# Altium project DSP_TMS320.PrjPcb
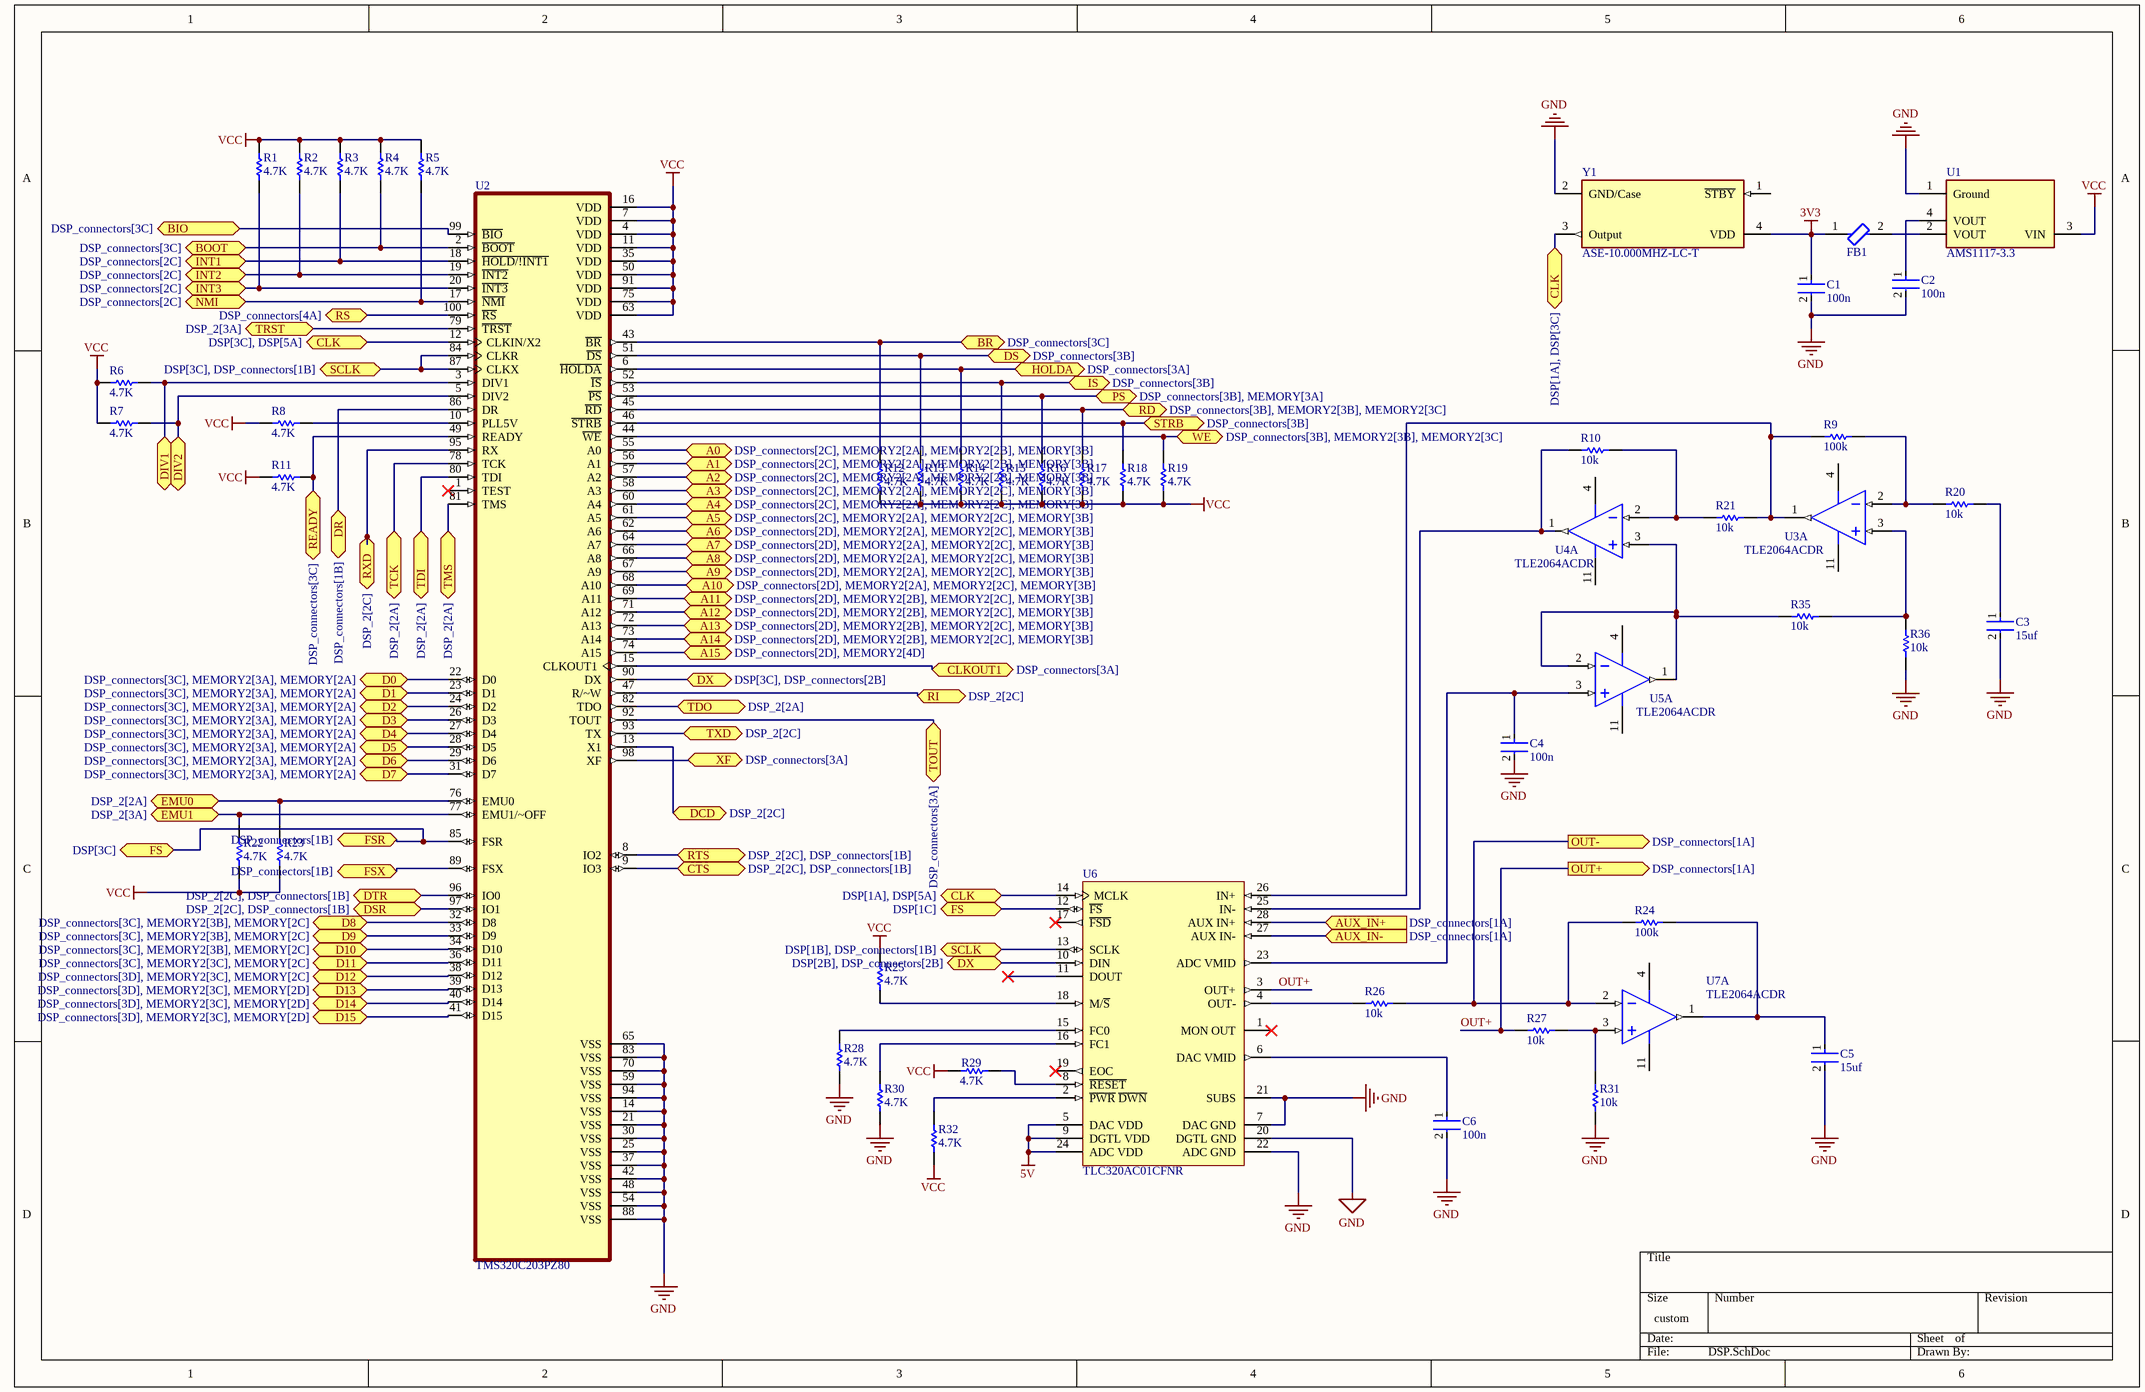
[diagram p0: DSP.SchDoc]
6 sheets, 84 parts. Net scope: flat (ports and power ports of the same name join across sheets).
Board file: DSP.PcbDoc
Sheets:
  DSP.SchDoc
  DSP_connectors.SchDoc
  DSP_2.SchDoc
  MEMORY.SchDoc
  MEMORY2.SchDoc
  power.SchDoc

## Sheet DSP.SchDoc
size 400 x 260 mm; SheetNumber: 1; SheetTotal: 6

### Parts
C1  100n  [FP-CL10-IPC_C]
C2  100n  [FP-CL10-IPC_C]
C3  15uf  [FP-CL10-IPC_C]
C4  100n  [FP-CL10-IPC_C]
C5  15uf  [FP-CL10-IPC_C]
C6  100n  [FP-CL10-IPC_C]
FB1  BLM18KG121TN1D  [FP-BLM18-0_15-t0_6-d1_2-IPC_A]  (value not drawn)
R1  4.7K  [RESC2013X60X35ML10T20]
R2  4.7K  [RESC2013X60X35ML10T20]
R3  4.7K  [RESC2013X60X35ML10T20]
R4  4.7K  [RESC2013X60X35ML10T20]
R5  4.7K  [RESC2013X60X35ML10T20]
R6  4.7K  [RESC2013X60X35ML10T20]
R7  4.7K  [RESC2013X60X35ML10T20]
R8  4.7K  [RESC2013X60X35ML10T20]
R9  100k  [RESC2013X60X35ML10T20]
R10  10k  [RESC2013X60X35ML10T20]
R11  4.7K  [RESC2013X60X35ML10T20]
R12  4.7K  [RESC2013X60X35ML10T20]
R13  4.7K  [RESC2013X60X35ML10T20]
R14  4.7K  [RESC2013X60X35ML10T20]
R15  4.7K  [RESC2013X60X35ML10T20]
R16  4.7K  [RESC2013X60X35ML10T20]
R17  4.7K  [RESC2013X60X35ML10T20]
R18  4.7K  [RESC2013X60X35ML10T20]
R19  4.7K  [RESC2013X60X35ML10T20]
R20  10k  [RESC2013X60X35ML10T20]
R21  10k  [RESC2013X60X35ML10T20]
R22  4.7K  [RESC2013X60X35ML10T20]
R23  4.7K  [RESC2013X60X35ML10T20]
R24  100k  [RESC2013X60X35ML10T20]
R25  4.7K  [RESC2013X60X35ML10T20]
R26  10k  [RESC2013X60X35ML10T20]
R27  10k  [RESC2013X60X35ML10T20]
R28  4.7K  [RESC2013X60X35ML10T20]
R29  4.7K  [RESC2013X60X35ML10T20]
R30  4.7K  [RESC2013X60X35ML10T20]
R31  10k  [RESC2013X60X35ML10T20]
R32  4.7K  [RESC2013X60X35ML10T20]
R35  10k  [RESC2013X60X35ML10T20]
R36  10k  [RESC2013X60X35ML10T20]
U1  AMS1117-3.3  [FP-AMS1117-IPC_C]
U2  TMS320C203PZ80  [QFP50P1600X1600X160-100N]
U3  TLE2064ACDR  [D0014A_M]  (part A of 4)
U4  TLE2064ACDR  [D0014A_M]  (part A of 4)
U5  TLE2064ACDR  [D0014A_M]  (part A of 4)
U6  TLC320AC01CFNR  [FN0028A_L]
U7  TLE2064ACDR  [D0014A_M]  (part A of 4)
Y1  ASE-10.000MHZ-LC-T  [FP-ASE-MFG]

### Ports
A0 (bidir, see DSP_connectors[2C], MEMORY2[2A], MEMORY2[2B], MEMORY[3B]), A1 (bidir, see DSP_connectors[2C], MEMORY2[2A], MEMORY2[2B], MEMORY[3B]), A2 (bidir, see DSP_connectors[2C], MEMORY2[2A], MEMORY2[2B], MEMORY[3B]), A3 (bidir, see DSP_connectors[2C], MEMORY2[2A], MEMORY2[2C], MEMORY[3B]), A4 (bidir, see DSP_connectors[2C], MEMORY2[2A], MEMORY2[2C], MEMORY[3B]), A5 (bidir, see DSP_connectors[2C], MEMORY2[2A], MEMORY2[2C], MEMORY[3B]), A6 (bidir, see DSP_connectors[2D], MEMORY2[2A], MEMORY2[2C], MEMORY[3B]), A7 (bidir, see DSP_connectors[2D], MEMORY2[2A], MEMORY2[2C], MEMORY[3B]), A8 (bidir, see DSP_connectors[2D], MEMORY2[2A], MEMORY2[2C], MEMORY[3B]), A9 (bidir, see DSP_connectors[2D], MEMORY2[2A], MEMORY2[2C], MEMORY[3B]), A10 (bidir, see DSP_connectors[2D], MEMORY2[2A], MEMORY2[2C], MEMORY[3B]), A11 (bidir, see DSP_connectors[2D], MEMORY2[2B], MEMORY2[2C], MEMORY[3B]), A12 (bidir, see DSP_connectors[2D], MEMORY2[2B], MEMORY2[2C], MEMORY[3B]), A13 (bidir, see DSP_connectors[2D], MEMORY2[2B], MEMORY2[2C], MEMORY[3B]), A14 (bidir, see DSP_connectors[2D], MEMORY2[2B], MEMORY2[2C], MEMORY[3B]), A15 (bidir, see DSP_connectors[2D], MEMORY2[4D]), AUX_IN+ (in, see DSP_connectors[1A]), AUX_IN- (in, see DSP_connectors[1A]), BIO (bidir, see DSP_connectors[3C]), BOOT (bidir, see DSP_connectors[3C]), BR (bidir, see DSP_connectors[3C]), CLK (bidir, see DSP[1A], DSP[3C]), CLK (bidir, see DSP[1A], DSP[5A]), CLK (bidir, see DSP[3C], DSP[5A]), CLKOUT1 (bidir, see DSP_connectors[3A]), CTS (bidir, see DSP_2[2C], DSP_connectors[1B]), D0 (bidir, see DSP_connectors[3C], MEMORY2[3A], MEMORY[2A]), D1 (bidir, see DSP_connectors[3C], MEMORY2[3A], MEMORY[2A]), D2 (bidir, see DSP_connectors[3C], MEMORY2[3A], MEMORY[2A]), D3 (bidir, see DSP_connectors[3C], MEMORY2[3A], MEMORY[2A]), D4 (bidir, see DSP_connectors[3C], MEMORY2[3A], MEMORY[2A]), D5 (bidir, see DSP_connectors[3C], MEMORY2[3A], MEMORY[2A]), D6 (bidir, see DSP_connectors[3C], MEMORY2[3A], MEMORY[2A]), D7 (bidir, see DSP_connectors[3C], MEMORY2[3A], MEMORY[2A]), D8 (bidir, see DSP_connectors[3C], MEMORY2[3B], MEMORY[2C]), D9 (bidir, see DSP_connectors[3C], MEMORY2[3B], MEMORY[2C]), D10 (bidir, see DSP_connectors[3C], MEMORY2[3B], MEMORY[2C]), D11 (bidir, see DSP_connectors[3C], MEMORY2[3C], MEMORY[2C]), D12 (bidir, see DSP_connectors[3D], MEMORY2[3C], MEMORY[2C]), D13 (bidir, see DSP_connectors[3D], MEMORY2[3C], MEMORY[2D]), D14 (bidir, see DSP_connectors[3D], MEMORY2[3C], MEMORY[2D]), D15 (bidir, see DSP_connectors[3D], MEMORY2[3C], MEMORY[2D]), DCD (bidir, see DSP_2[2C]), DIV1 (bidir), DIV2 (bidir), DR (bidir, see DSP_connectors[1B]), DS (bidir, see DSP_connectors[3B]), DSR (bidir, see DSP_2[2C], DSP_connectors[1B]), DTR (bidir, see DSP_2[2C], DSP_connectors[1B]), DX (bidir, see DSP[2B], DSP_connectors[2B]), DX (bidir, see DSP[3C], DSP_connectors[2B]), EMU0 (bidir, see DSP_2[2A]), EMU1 (bidir, see DSP_2[3A]), FS (bidir, see DSP[1C]), FS (bidir, see DSP[3C]), FSR (bidir, see DSP_connectors[1B]), FSX (bidir, see DSP_connectors[1B]), HOLDA (bidir, see DSP_connectors[3A]), INT1 (bidir, see DSP_connectors[2C]), INT2 (bidir, see DSP_connectors[2C]), INT3 (bidir, see DSP_connectors[2C]), IS (bidir, see DSP_connectors[3B]), NMI (bidir, see DSP_connectors[2C]), OUT+ (out, see DSP_connectors[1A]), OUT- (out, see DSP_connectors[1A]), PS (bidir, see DSP_connectors[3B], MEMORY[3A]), RD (bidir, see DSP_connectors[3B], MEMORY2[3B], MEMORY2[3C]), READY (bidir, see DSP_connectors[3C]), RI (bidir, see DSP_2[2C]), RS (bidir, see DSP_connectors[4A]), RTS (bidir, see DSP_2[2C], DSP_connectors[1B]), RXD (bidir, see DSP_2[2C]), SCLK (bidir, see DSP[1B], DSP_connectors[1B]), SCLK (bidir, see DSP[3C], DSP_connectors[1B]), STRB (bidir, see DSP_connectors[3B]), TCK (bidir, see DSP_2[2A]), TDI (bidir, see DSP_2[2A]), TDO (bidir, see DSP_2[2A]), TMS (bidir, see DSP_2[2A]), TOUT (bidir, see DSP_connectors[3A]), TRST (bidir, see DSP_2[3A]), TXD (bidir, see DSP_2[2C]), WE (bidir, see DSP_connectors[3B], MEMORY2[3B], MEMORY2[3C]), XF (bidir, see DSP_connectors[3A])

### Nets
3V3: C1.1 FB1.1 Y1.4(VDD)
5V: U6.5(DAC_VDD) U6.9(DGTL_VDD) U6.24(ADC_VDD)
GND: C1.2 C2.2 C3.2 C4.2 C5.2 C6.2 R28.2 R30.1 R31.1 R36.2 U1.1(Ground) U2.14(VSS) U2.21(VSS) U2.25(VSS) U2.30(VSS) U2.37(VSS) U2.42(VSS) U2.48(VSS) U2.54(VSS) U2.59(VSS) U2.65(VSS) U2.70(VSS) U2.83(VSS) U2.88(VSS) U2.94(VSS) U6.7(DAC_GND) U6.20(DGTL_GND) U6.21(SUBS) U6.22(ADC_GND) Y1.2(GND/Case)
VCC: R1.2 R2.2 R3.2 R4.2 R5.2 R6.2 R7.2 R8.1 R11.1 R12.2 R13.2 R14.2 R15.2 R16.2 R17.2 R18.2 R19.2 R22.1 R23.1 R25.2 R29.2 R32.1 U1.3(VIN) U2.4(VDD) U2.7(VDD) U2.11(VDD) U2.16(VDD) U2.35(VDD) U2.50(VDD) U2.63(VDD) U2.75(VDD) U2.91(VDD)
OUT+: R27.2 U6.3(OUT+) ; port OUT+
NetC2_1: C2.1 U1.4(VOUT)
NetC3_1: C3.1 R20.2
NetC4_1: C4.1 U5.3(IN1+) U6.23(ADC_VMID)
NetC5_1: C5.1 R24.1 U7.1(OUT1)
NetC6_1: C6.1 U6.6(DAC_VMID)
NetFB1_2: FB1.2 U1.2(VOUT)
NetJ1_3: R24.2 R26.1 U7.2(IN1-) ; port OUT-
NetJ1_5: U6.27(AUX_IN-) ; port AUX_IN-
NetJ1_6: U6.28(AUX_IN+) ; port AUX_IN+
NetJ1_14: U2.84(CLKR) U2.87(CLKX) U6.13(SCLK) ; port SCLK
NetJ1_17: U2.96(IO0) ; port DTR
NetJ1_18: U2.85(FSR) U6.12(~{FS}) ; port FS, port FSR
NetJ1_19: U2.97(IO1) ; port DSR
NetJ1_20: U2.89(FSX) ; port FSX
NetJ1_21: U2.8(IO2) ; port RTS
NetJ1_22: U2.86(DR) ; port DR
NetJ1_23: U2.9(IO3) ; port CTS
NetJ1_24: U2.90(DX) U6.10(DIN) ; port DX
NetJ2_1: U2.100(~{RS}) ; port RS
NetJ2_2: U2.92(TOUT) ; port TOUT
NetJ2_5: U2.98(XF) ; port XF
NetJ2_6: R14.1 U2.6(~{HOLDA}) ; port HOLDA
NetJ2_9: U2.15(CLKOUT1) ; port CLKOUT1
NetJ2_17: R18.1 U2.46(~{STRB}) ; port STRB
NetJ2_19: R16.1 U2.53(~{PS}) ; port PS
NetJ2_21: R13.1 U2.51(~{DS}) ; port DS
NetJ2_22: R15.1 U2.52(~{IS}) ; port IS
NetJ2_23: R17.1 U2.45(~{RD}) ; port RD
NetJ2_24: R19.1 U2.44(~{WE}) ; port WE
NetJ3_3: R11.2 U2.49(READY) ; port READY
NetJ3_4: R4.1 U2.2(~{BOOT}) ; port BOOT
NetJ3_5: U2.99(~{BIO}) ; port BIO
NetJ3_6: R12.1 U2.43(~{BR}) ; port BR
NetJ3_9: U2.22(D0) ; port D0
NetJ3_10: U2.23(D1) ; port D1
NetJ3_11: U2.24(D2) ; port D2
NetJ3_12: U2.26(D3) ; port D3
NetJ3_13: U2.27(D4) ; port D4
NetJ3_14: U2.28(D5) ; port D5
NetJ3_15: U2.29(D6) ; port D6
NetJ3_16: U2.31(D7) ; port D7
NetJ3_17: U2.32(D8) ; port D8
NetJ3_18: U2.33(D9) ; port D9
NetJ3_19: U2.34(D10) ; port D10
NetJ3_20: U2.36(D11) ; port D11
NetJ3_21: U2.38(D12) ; port D12
NetJ3_22: U2.39(D13) ; port D13
NetJ3_23: U2.40(D14) ; port D14
NetJ3_24: U2.41(D15) ; port D15
NetJ4_1: R3.1 U2.18(~{HOLD/!INT1}) ; port INT1
NetJ4_2: R2.1 U2.19(~{INT2}) ; port INT2
NetJ4_3: R1.1 U2.20(~{INT3}) ; port INT3
NetJ4_5: R5.1 U2.17(~{NMI}) ; port NMI
NetJ4_9: U2.55(A0) ; port A0
NetJ4_10: U2.56(A1) ; port A1
NetJ4_11: U2.57(A2) ; port A2
NetJ4_12: U2.58(A3) ; port A3
NetJ4_13: U2.60(A4) ; port A4
NetJ4_14: U2.61(A5) ; port A5
NetJ4_15: U2.62(A6) ; port A6
NetJ4_16: U2.64(A7) ; port A7
NetJ4_17: U2.66(A8) ; port A8
NetJ4_18: U2.67(A9) ; port A9
NetJ4_19: U2.68(A10) ; port A10
NetJ4_20: U2.69(A11) ; port A11
NetJ4_21: U2.71(A12) ; port A12
NetJ4_22: U2.72(A13) ; port A13
NetJ4_23: U2.73(A14) ; port A14
NetJ4_24: U2.74(A15) ; port A15
NetJ5_1: U2.81(TMS) ; port TMS
NetJ5_2: U2.79(~{TRST}) ; port TRST
NetJ5_3: U2.80(TDI) ; port TDI
NetJ5_7: U2.82(TDO) ; port TDO
NetJ5_9: U2.78(TCK) ; port TCK
NetJ5_13: R23.2 U2.76(EMU0) ; port EMU0
NetJ5_14: R22.2 U2.77(EMU1/~OFF) ; port EMU1
NetJ6_1: U2.13(X1) ; port DCD
NetJ6_2: U2.93(TX) ; port TXD
NetJ6_5: U2.47(R/~W) ; port RI
NetJ6_6: U2.95(RX) ; port RXD
NetR6_1: R6.1 U2.3(DIV1) ; port DIV1
NetR7_1: R7.1 U2.5(DIV2) ; port DIV2
NetR8_2: R8.2 U2.10(PLL5V)
NetR9_1: R9.1 R20.1 U3.2(IN1-)
NetR9_2: R9.2 R21.1 U3.1(OUT1) U6.26(IN+)
NetR10_1: R10.1 R21.2 U4.2(IN1-)
NetR10_2: R10.2 U4.1(OUT1) U6.25(IN-)
NetR25_1: R25.1 U6.18(M/~{S})
NetR26_2: R26.2 U6.4(OUT-)
NetR27_1: R27.1 R31.2 U7.3(IN1+)
NetR28_1: R28.1 U6.15(FC0)
NetR29_1: R29.1 U6.8(~{RESET})
NetR30_2: R30.2 U6.16(FC1)
NetR32_2: R32.2 U6.2(~{PWR}_~{DWN})
NetR35_1: R35.1 R36.1 U3.3(IN1+)
NetR35_2: R35.2 U4.3(IN1+) U5.1(OUT1) U5.2(IN1-)
NetU2_12: U2.12(CLKIN/X2) U6.14(MCLK) Y1.3(Output) ; port CLK

Not connected (* = marked no-connect by the designer): U2 1(TEST)*; U3 4(VCC+) 11(VCC-); U4 4(VCC+) 11(VCC-); U5 4(VCC+) 11(VCC-); U6 1(MON_OUT)* 11(DOUT)* 17(~{FSD})* 19(EOC)*; U7 4(VCC+) 11(VCC-); Y1 1(~{STBY})

### Library data of the parts
C1-C6 = CMP-13271-003017-1: Cap Ceramic 4.7uF 10V X5R ±10% Pad SMD 0603 +85°C T/R; Capacitance: 4.7uF; Case/Package: 0603; Packaging: Tape and Reel; Width: 0.031inch; Contact Plating: Tin; Thickness: 0.035inch; Package Quantity: 1; Voltage Rating: 10V; Case Code (Metric): 1608; Case Code (Imperial): 0603; Depth: 0.8mm; Height: 0.8mm; Tolerance: 10%; Max Operating Temperature: 85°C; Length: 1.6mm; Dielectric: X5R; Mount: Surface Mount; Radiation Hardening: No; Min Operating Temperature: -55°C
FB1 = CMP-0686-00554-8: FERRITE BEAD 120 OHM 0603 1LN; Max Current Rating: 3A; DC Resistance (DCR): 30mR; Impedance: 120R; Number of Lines: 1; Test Frequency: 100MHz; Tolerance: 25%; Package Quantity: 4000; Min Operating Temperature: -55°C; Termination: SMD/SMT; REACH SVHC: No SVHC; Core Material: Ferrite; Material: Ferrite; Current Rating: 3A; Height: 0.8mm; Number of Pins: 2; Case/Package: 0603; Case Code (Imperial): 0603; Series: BLM18K; Packaging: Tape and Reel; Inductor Type: FERRITE BEAD; Lead Free: Lead Free; Width: 0.8mm; Case Code (Metric): 1608; Number of Circuits: 1; Max DC Current: 3A; Depth: 0.95mm; Max Operating Temperature: 125°C; Length: 1.6mm; RoHS Compliant: Yes
R1-R32 R35 R36 = CMP-2100-03673-1: Chip Resistor, 0 Ohm, Jumper, +/- 5%, 0.125 W, -55 to 155 degC, 0805 (2012 Metric), RoHS, Tape and Reel; Manufacturer: Yageo; Power Rating: 125mW; Resistance: 0mOhm; Voltage Rating (DC): 150V; Temperature Coefficient: 200ppm/degreesC; Height: 0.5mm; Depth: 1.25mm; Case Code (Imperial): 0805; Lead Free: LeadFree; Military Standard: Not; Package Description: 2-Pin Surface Mounted Device, Body 2 x 1.25 mm; Case Code (Metric): 2012; Composition: ThickFilm; Voltage Rating: 150V; Manufacturer URL: http://www.yageo.com/; Packaging: TapeandReel; Package Reference: 0805; REACH SVHC: Unknown; Tolerance: 5%; Case/Package: 0805; Max Operating Temperature: 155degC; Number of Pins: 2; Min Operating Temperature: -55degC; RoHSCompliant: true; Length: 2mm; Datasheet URL: http://www.yageo.com/NewPortal/yageodocoutput?fileName=/pdf/R-Chip/PYu-RC_Group_51_RoHS_L_5.pdf; Termination: SMD/SMT; Radiation Hardening: No; Width: 1.25mm; Contact Plating: Tin; Datasheet Version: Rev. 5, 10/2016
U1 = CMP-209535-000001-1: LDO Voltage Regulators 1A, 3.3V; Manufacturer: Advanced Monolithic Systems; Dropout Voltage: 1.1V; Output Type: Fixed; Nominal Supply Current: 5mA; Max Power Dissipation: 1.2W; Max Supply Voltage: 15V; Number Of Outputs: 1; Standoff Height: 0.64mm; Max Junction Temp: +125°C; Height: 1.8mm; Package: AMS1117; Device Class L2: Power Management ICs; ComponentLink2Description: Datasheet; ComponentLink2URL: http://www.advanced-monolithic.com/pdf/ds1117.pdf; Category: IC; RoHS: TRUE; Automotive: No; Device Class L1: Integrated Circuits (ICs); Output Current: 1A; Device Class L3: Voltage Regulators - Linear; Temperature: -40°C to +125°C; Output Voltage: 3.3V; Manufacturer Part Number: AMS1117-3.3; Temperature Range Low: -40°C; Octopart: https://octopart.com/ams1117-3.3-advanced+monolithic+systems-25899300; Lead Free: Yes; Ipc Land Pattern Name: SOT229P700X180-4; Temperature Range High: +125°C
U3-U5 U7 = CMP-0272-01885-3: Excalibur JFET-Input High-Output-Drive uPower Quad Operational Amplifier, 7 to 36 V, 0 to70 degC, 14-pin SOIC (D14), Green (RoHS & no Sb/Br); Manufacturer: Texas Instruments; IIB(Max)(pA): 2000; Vio (25C)(Max)(mV): 6; Total Supply Voltage(Min)(+5V is 5, +/-5V is 10): 7; Rating: Catalog; Sub Family: High Supply Voltage Amplifier (>=30V), Low Power Amp (<=500uA), Precision Amplifier; CMRR(Min)(dB): 65; Packing: LARGE T&R; Total Supply Voltage(Max)(+5V is 5, +/-5V is 10): 36; Number of Channels: 4; Iq per channel(Max)(mA): 0.325; Slew Rate(Typ)(V/us): 3.4; GBW(Typ)(MHz): 1.8; Code_JEDEC: MS-012; Eco-Plan: Green (RoHS & no Sb/Br); ComponentLink2Description: Datasheet; PackageVersion: 4040047-5/M, 06/2011; ComponentLink3Description: Package Specification; Offset Drift(Typ)(uV/C): 6; PackageDescription: 14-Pin Plastic Small Outline, Body 8.65 x 3.9 mm, Pitch 1.27 mm; Mounting Technology: Surface Mount; PackageReference: D0014A; ComponentLink2URL: http://www.ti.com/lit/ds/symlink/tle2064a.pdf; DatasheetVersion: SLOS193B; ComponentLink3URL: http://www.ti.com/lit/ml/mpds177g/mpds177g.pdf; PartNumber: TLE2064ACDR; ComponentLink1Description: Manufacturer URL; ComponentLink1URL: http://www.ti.com/
U6 = CMP-0331-00025-2: Single Channel CODEC-Bandwidth Independent of Sampling Rate, 0 to 70 degC, 28-pin PLCC (FN), Green (RoHS & no Sb/Br); Manufacturer: Texas Instruments; Sampling Rate (Max) (kHz): 25; Line Powered: TRUE; PackageDescription: 28-Pin Plastic J-Leaded Chip Carrier, 1.27 mm Pitch; DatasheetVersion: SLAS057D; PackageVersion: revB, Mar-1995; ComponentLink1Description: Datasheet; ComponentLink1URL: http://www.ti.com/general/docs/lit/getliterature.tsp?genericPartNumber=TLC320AC01&fileType=pdf; Mounting Technology: Surface Mount; Code_JEDEC: MS-018; PartNumber: TLC320AC01CFNR; PackageReference: FN0028A
Y1 = CMP-27762-014276-1: XTAL Oscillator 10MHz ±50ppm CMOS 3.3V 4-SMD 3.2mm x 2.5mm; Max Supply Voltage: 3.465V; Max Supply Current: 7mA; Load Capacitance: 15pF; Min Supply Voltage: 3.135V; Number of Pins: 4; Case/Package: SMD/SMT; Lead Free: Lead Free; Depth: 2.5mm; Radiation Hardening: No; Width: 0.098inch; Length: 3.2mm; Termination: SMD/SMT; Min Operating Temperature: -40°C; Operating Supply Voltage: 3.3V; Series: ASE; Packaging: Tape and Reel; REACH SVHC: No SVHC; Mount: Surface Mount; Frequency: 10MHz; Package Quantity: 1000; Max Operating Temperature: 85°C; Operating Frequency: 10 MHz; Height: 0.047inch; Frequency Stability: 50ppm
U2 = TMS320C203PZ80: Package: None; Price: None; Value: *; MP: TMS320C203PZ80; Availability: Unavailable

## Sheet DSP_connectors.SchDoc
size A; SheetNumber: 2; SheetTotal: 6
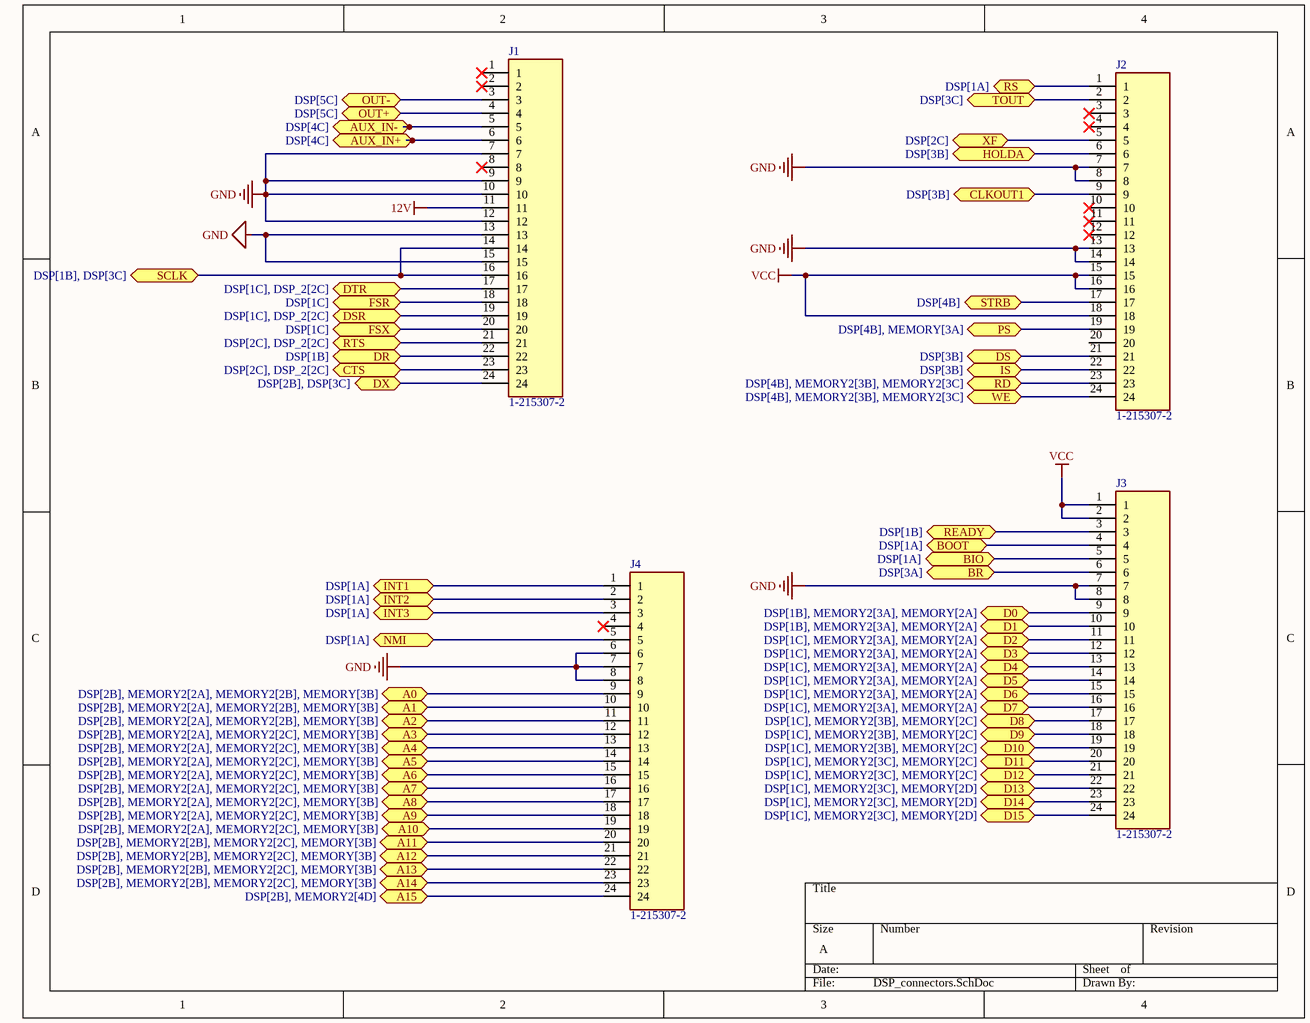
[diagram p1: DSP_connectors.SchDoc]

### Parts
J1  1-215307-2  [TE_1-215307-2]
J2  1-215307-2  [TE_1-215307-2]
J3  1-215307-2  [TE_1-215307-2]
J4  1-215307-2  [TE_1-215307-2]

### Ports
A0 (bidir, see DSP[2B], MEMORY2[2A], MEMORY2[2B], MEMORY[3B]), A1 (bidir, see DSP[2B], MEMORY2[2A], MEMORY2[2B], MEMORY[3B]), A2 (bidir, see DSP[2B], MEMORY2[2A], MEMORY2[2B], MEMORY[3B]), A3 (bidir, see DSP[2B], MEMORY2[2A], MEMORY2[2C], MEMORY[3B]), A4 (bidir, see DSP[2B], MEMORY2[2A], MEMORY2[2C], MEMORY[3B]), A5 (bidir, see DSP[2B], MEMORY2[2A], MEMORY2[2C], MEMORY[3B]), A6 (bidir, see DSP[2B], MEMORY2[2A], MEMORY2[2C], MEMORY[3B]), A7 (bidir, see DSP[2B], MEMORY2[2A], MEMORY2[2C], MEMORY[3B]), A8 (bidir, see DSP[2B], MEMORY2[2A], MEMORY2[2C], MEMORY[3B]), A9 (bidir, see DSP[2B], MEMORY2[2A], MEMORY2[2C], MEMORY[3B]), A10 (bidir, see DSP[2B], MEMORY2[2A], MEMORY2[2C], MEMORY[3B]), A11 (bidir, see DSP[2B], MEMORY2[2B], MEMORY2[2C], MEMORY[3B]), A12 (bidir, see DSP[2B], MEMORY2[2B], MEMORY2[2C], MEMORY[3B]), A13 (bidir, see DSP[2B], MEMORY2[2B], MEMORY2[2C], MEMORY[3B]), A14 (bidir, see DSP[2B], MEMORY2[2B], MEMORY2[2C], MEMORY[3B]), A15 (bidir, see DSP[2B], MEMORY2[4D]), AUX_IN+ (bidir, see DSP[4C]), AUX_IN- (bidir, see DSP[4C]), BIO (bidir, see DSP[1A]), BOOT (bidir, see DSP[1A]), BR (bidir, see DSP[3A]), CLKOUT1 (bidir, see DSP[3B]), CTS (bidir, see DSP[2C], DSP_2[2C]), D0 (bidir, see DSP[1B], MEMORY2[3A], MEMORY[2A]), D1 (bidir, see DSP[1B], MEMORY2[3A], MEMORY[2A]), D2 (bidir, see DSP[1C], MEMORY2[3A], MEMORY[2A]), D3 (bidir, see DSP[1C], MEMORY2[3A], MEMORY[2A]), D4 (bidir, see DSP[1C], MEMORY2[3A], MEMORY[2A]), D5 (bidir, see DSP[1C], MEMORY2[3A], MEMORY[2A]), D6 (bidir, see DSP[1C], MEMORY2[3A], MEMORY[2A]), D7 (bidir, see DSP[1C], MEMORY2[3A], MEMORY[2A]), D8 (bidir, see DSP[1C], MEMORY2[3B], MEMORY[2C]), D9 (bidir, see DSP[1C], MEMORY2[3B], MEMORY[2C]), D10 (bidir, see DSP[1C], MEMORY2[3B], MEMORY[2C]), D11 (bidir, see DSP[1C], MEMORY2[3C], MEMORY[2C]), D12 (bidir, see DSP[1C], MEMORY2[3C], MEMORY[2C]), D13 (bidir, see DSP[1C], MEMORY2[3C], MEMORY[2D]), D14 (bidir, see DSP[1C], MEMORY2[3C], MEMORY[2D]), D15 (bidir, see DSP[1C], MEMORY2[3C], MEMORY[2D]), DR (bidir, see DSP[1B]), DS (bidir, see DSP[3B]), DSR (bidir, see DSP[1C], DSP_2[2C]), DTR (bidir, see DSP[1C], DSP_2[2C]), DX (bidir, see DSP[2B], DSP[3C]), FSR (bidir, see DSP[1C]), FSX (bidir, see DSP[1C]), HOLDA (bidir, see DSP[3B]), INT1 (bidir, see DSP[1A]), INT2 (bidir, see DSP[1A]), INT3 (bidir, see DSP[1A]), IS (bidir, see DSP[3B]), NMI (bidir, see DSP[1A]), OUT+ (bidir, see DSP[5C]), OUT- (bidir, see DSP[5C]), PS (bidir, see DSP[4B], MEMORY[3A]), RD (bidir, see DSP[4B], MEMORY2[3B], MEMORY2[3C]), READY (bidir, see DSP[1B]), RS (bidir, see DSP[1A]), RTS (bidir, see DSP[2C], DSP_2[2C]), SCLK (bidir, see DSP[1B], DSP[3C]), STRB (bidir, see DSP[4B]), TOUT (bidir, see DSP[3C]), WE (bidir, see DSP[4B], MEMORY2[3B], MEMORY2[3C]), XF (bidir, see DSP[2C])

### Nets
12V: J1.11
GND: J1.7 J1.9 J1.10 J1.12 J1.13 J1.15 J2.7 J2.8 J2.13 J2.14 J3.7 J3.8 J4.6 J4.7 J4.8
VCC: J2.15 J2.16 J2.18 J3.1 J3.2
OUT+: J1.4 ; port OUT+
NetJ1_3: J1.3 ; port OUT-
NetJ1_5: J1.5 ; port AUX_IN-
NetJ1_6: J1.6 ; port AUX_IN+
NetJ1_14: J1.14 J1.16 ; port SCLK
NetJ1_17: J1.17 ; port DTR
NetJ1_18: J1.18 ; port FSR
NetJ1_19: J1.19 ; port DSR
NetJ1_20: J1.20 ; port FSX
NetJ1_21: J1.21 ; port RTS
NetJ1_22: J1.22 ; port DR
NetJ1_23: J1.23 ; port CTS
NetJ1_24: J1.24 ; port DX
NetJ2_1: J2.1 ; port RS
NetJ2_2: J2.2 ; port TOUT
NetJ2_5: J2.5 ; port XF
NetJ2_6: J2.6 ; port HOLDA
NetJ2_9: J2.9 ; port CLKOUT1
NetJ2_17: J2.17 ; port STRB
NetJ2_19: J2.19 ; port PS
NetJ2_21: J2.21 ; port DS
NetJ2_22: J2.22 ; port IS
NetJ2_23: J2.23 ; port RD
NetJ2_24: J2.24 ; port WE
NetJ3_3: J3.3 ; port READY
NetJ3_4: J3.4 ; port BOOT
NetJ3_5: J3.5 ; port BIO
NetJ3_6: J3.6 ; port BR
NetJ3_9: J3.9 ; port D0
NetJ3_10: J3.10 ; port D1
NetJ3_11: J3.11 ; port D2
NetJ3_12: J3.12 ; port D3
NetJ3_13: J3.13 ; port D4
NetJ3_14: J3.14 ; port D5
NetJ3_15: J3.15 ; port D6
NetJ3_16: J3.16 ; port D7
NetJ3_17: J3.17 ; port D8
NetJ3_18: J3.18 ; port D9
NetJ3_19: J3.19 ; port D10
NetJ3_20: J3.20 ; port D11
NetJ3_21: J3.21 ; port D12
NetJ3_22: J3.22 ; port D13
NetJ3_23: J3.23 ; port D14
NetJ3_24: J3.24 ; port D15
NetJ4_1: J4.1 ; port INT1
NetJ4_2: J4.2 ; port INT2
NetJ4_3: J4.3 ; port INT3
NetJ4_5: J4.5 ; port NMI
NetJ4_9: J4.9 ; port A0
NetJ4_10: J4.10 ; port A1
NetJ4_11: J4.11 ; port A2
NetJ4_12: J4.12 ; port A3
NetJ4_13: J4.13 ; port A4
NetJ4_14: J4.14 ; port A5
NetJ4_15: J4.15 ; port A6
NetJ4_16: J4.16 ; port A7
NetJ4_17: J4.17 ; port A8
NetJ4_18: J4.18 ; port A9
NetJ4_19: J4.19 ; port A10
NetJ4_20: J4.20 ; port A11
NetJ4_21: J4.21 ; port A12
NetJ4_22: J4.22 ; port A13
NetJ4_23: J4.23 ; port A14
NetJ4_24: J4.24 ; port A15

Not connected (* = marked no-connect by the designer): J1 1* 2* 8*; J2 3* 4* 10* 11* 12* 20; J4 4*

### Library data of the parts
J1-J4 = 1-215307-2: Package: None; Price: None; Value: *; MP: 1-215307-2; Availability: Unavailable

## Sheet DSP_2.SchDoc
size A; SheetNumber: 3; SheetTotal: 6
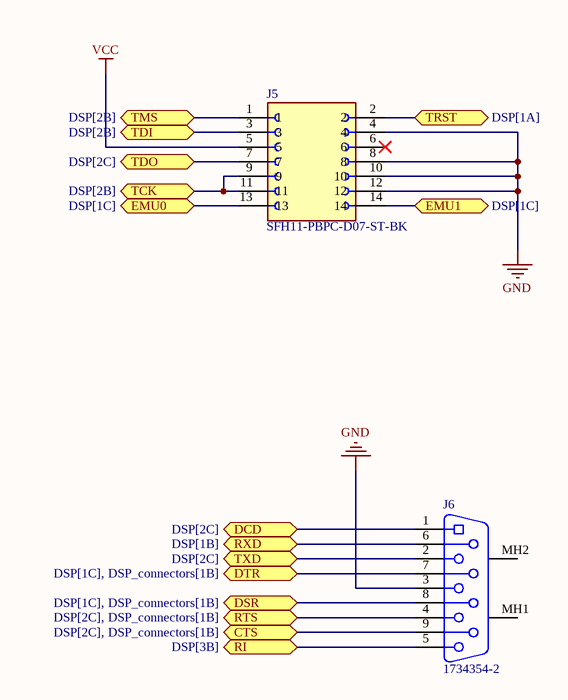
[diagram p2: DSP_2.SchDoc]

### Parts
J5  SFH11-PBPC-D07-ST-BK  [SULLINS_SFH11-PBPC-D07-ST-BK]
J6  1734354-2  [TECO-1734354-2_V]

### Ports
CTS (bidir, see DSP[2C], DSP_connectors[1B]), DCD (bidir, see DSP[2C]), DSR (bidir, see DSP[1C], DSP_connectors[1B]), DTR (bidir, see DSP[1C], DSP_connectors[1B]), EMU0 (bidir, see DSP[1C]), EMU1 (bidir, see DSP[1C]), RI (bidir, see DSP[3B]), RTS (bidir, see DSP[2C], DSP_connectors[1B]), RXD (bidir, see DSP[1B]), TCK (bidir, see DSP[2B]), TDI (bidir, see DSP[2B]), TDO (bidir, see DSP[2C]), TMS (bidir, see DSP[2B]), TRST (bidir, see DSP[1A]), TXD (bidir, see DSP[2C])

### Nets
GND: J5.4 J5.8 J5.10 J5.12 J6.3
VCC: J5.5
NetJ1_17: J6.7 ; port DTR
NetJ1_19: J6.8 ; port DSR
NetJ1_21: J6.4 ; port RTS
NetJ1_23: J6.9 ; port CTS
NetJ5_1: J5.1 ; port TMS
NetJ5_2: J5.2 ; port TRST
NetJ5_3: J5.3 ; port TDI
NetJ5_7: J5.7 ; port TDO
NetJ5_9: J5.9 J5.11 ; port TCK
NetJ5_13: J5.13 ; port EMU0
NetJ5_14: J5.14 ; port EMU1
NetJ6_1: J6.1 ; port DCD
NetJ6_2: J6.2 ; port TXD
NetJ6_5: J6.5 ; port RI
NetJ6_6: J6.6 ; port RXD

Not connected (* = marked no-connect by the designer): J5 6*; J6 MH1 MH2

### Library data of the parts
J5 = SFH11-PBPC-D07-ST-BK: 14 Position Header Connector Through Hole; MF: Sullins Connector; Value: *; Check_prices: https://www.snapeda.com/parts/SFH11-PBPC-D07-ST-BK/Sullins%20Connector%20Solutions/view-part/851415/?ref=eda; Availability: Warning; Package: None; SnapEDA_Link: https://www.snapeda.com/parts/SFH11-PBPC-D07-ST-BK/Sullins%20Connector%20Solutions/view-part/851415/?ref=snap; Purchase-URL: https://pricing.snapeda.com/search/part/SFH11-PBPC-D07-ST-BK/?ref=eda; Price: None; MP: SFH11-PBPC-D07-ST-BK
J6 = CMP-2000-05500-1: Female D-Sub Connector, Pitch 2.77 mm, 9 Position, Height 12.75 mm, Tail Length 3.2 mm, -55 to 105 degC, RoHS, Tray; Manufacturer: TE Connectivity; Product Training Modules: AMPLIMITED-SubConnectors; Flange Feature: MatingSide;FemaleScrewlock(4-40); Connector Type: Receptacle,FemaleSockets; 3D Model: 1734354-2.pdf; Dynamic Catalog: AMPLIMITEHD-20Series; Featured Product: AMPLIMITED-SubminiatureConnectors; Number of Positions: 9; Other Names: A35108; Current Rating: 2A; Voltage Rating: 250V; Mating Products: AML09B-ND / -CONND-SUBPLUG9POSGOLD; Catalog Drawings: AMPD-SubMale.318; Housing Material: Polyamide(PA9T),Nylon9T,GlassFilled; Connector Style: D-Sub; Datasheet Version: Rev. A1, 03/2011; Category: Connectors,Interconnects; Shell Material, Finish: Steel,NickelPlated; Standard Package: 90; Color: Black; Contact Finish: Gold; Contact Type: Signal; Contact Finish Thickness: 15µin(0.38µm); Datasheet URL: http://www.te.com/commerce/DocumentDelivery/DDEController?Action=showdoc&DocId=Customer+Drawing%7F1734354%7FA1%7Fpdf%7FEnglish%7FENG_CD_1734354_A1.pdf%7F1734354-2; Mounting Type: ThroughHole,RightAngle; Features: BoardLock; RoHS Information: 1734354-2StatementofCompliance; Series: AMPLIMITEHD-20; Number of Rows: 2; Termination: Solder; Package Description: Female D-Sub Connector, Pitch 2.77 mm, 9 Position, Height 12.75 mm, Tail Length 3.2 mm; Mounting Technology: ThroughHole; Shell Size, Connector Layout: 1(DE,E); Family: D-SubConnectors; Manufacturer URL: http://www.te.com/; Operating Temperature: -55°C~105°C; Package Reference: 1734354-2

## Sheet MEMORY.SchDoc
size A; SheetNumber: 4; SheetTotal: 6
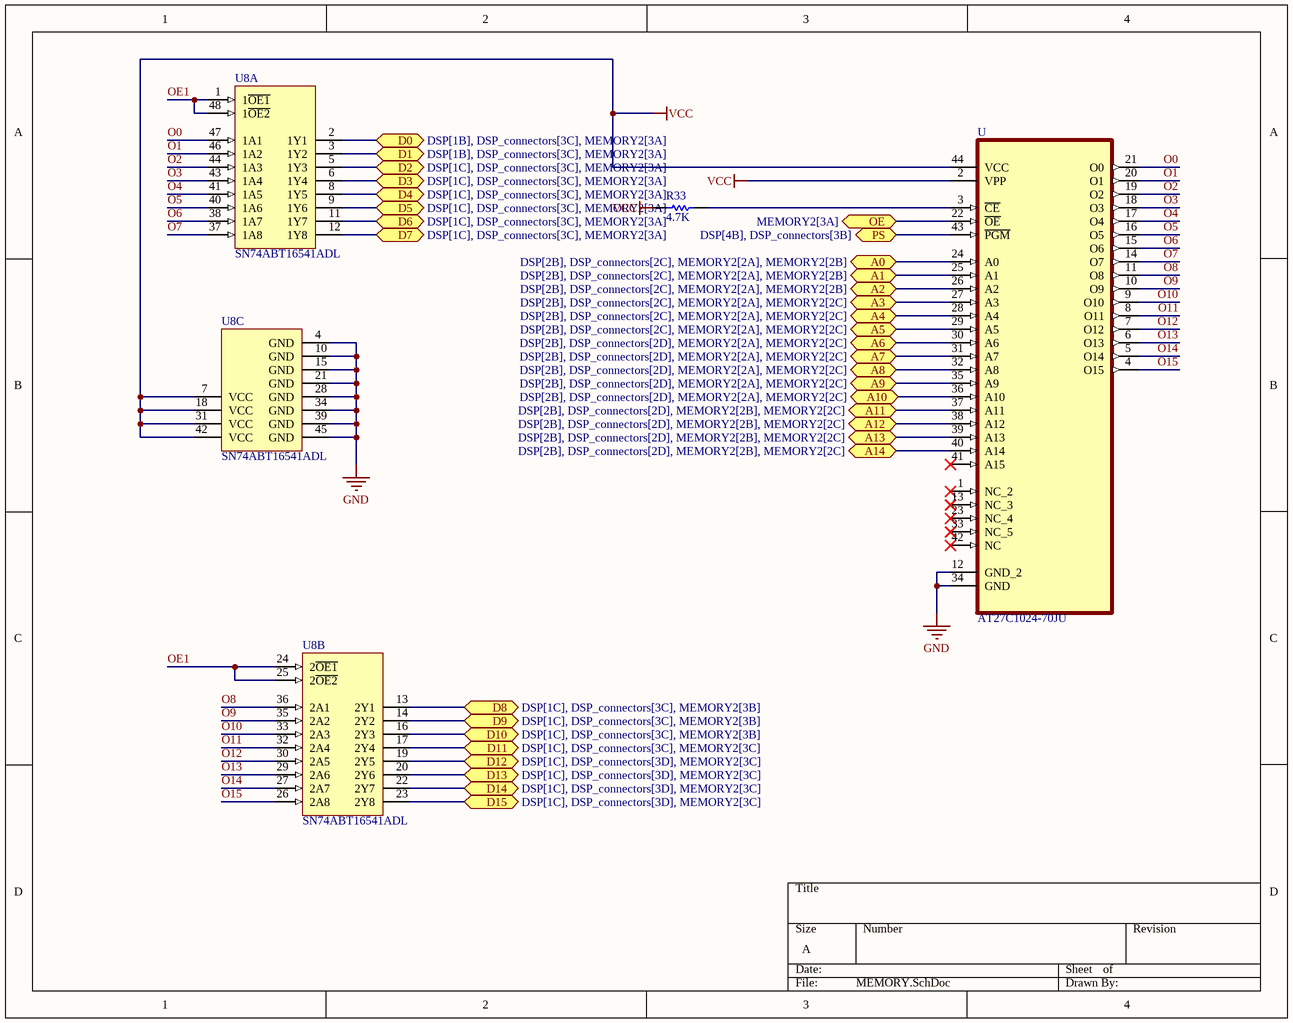
[diagram p3: MEMORY.SchDoc]

### Parts
R33  4.7K  [RESC2013X60X35ML10T20]
U  AT27C1024-70JU  [PLCC127P1752X1752X457-44N]
U8  SN74ABT16541ADL  [DL0048A_L]  (parts A,B,C of 3)

### Ports
A0 (bidir, see DSP[2B], DSP_connectors[2C], MEMORY2[2A], MEMORY2[2B]), A1 (bidir, see DSP[2B], DSP_connectors[2C], MEMORY2[2A], MEMORY2[2B]), A2 (bidir, see DSP[2B], DSP_connectors[2C], MEMORY2[2A], MEMORY2[2B]), A3 (bidir, see DSP[2B], DSP_connectors[2C], MEMORY2[2A], MEMORY2[2C]), A4 (bidir, see DSP[2B], DSP_connectors[2C], MEMORY2[2A], MEMORY2[2C]), A5 (bidir, see DSP[2B], DSP_connectors[2C], MEMORY2[2A], MEMORY2[2C]), A6 (bidir, see DSP[2B], DSP_connectors[2D], MEMORY2[2A], MEMORY2[2C]), A7 (bidir, see DSP[2B], DSP_connectors[2D], MEMORY2[2A], MEMORY2[2C]), A8 (bidir, see DSP[2B], DSP_connectors[2D], MEMORY2[2A], MEMORY2[2C]), A9 (bidir, see DSP[2B], DSP_connectors[2D], MEMORY2[2A], MEMORY2[2C]), A10 (bidir, see DSP[2B], DSP_connectors[2D], MEMORY2[2A], MEMORY2[2C]), A11 (bidir, see DSP[2B], DSP_connectors[2D], MEMORY2[2B], MEMORY2[2C]), A12 (bidir, see DSP[2B], DSP_connectors[2D], MEMORY2[2B], MEMORY2[2C]), A13 (bidir, see DSP[2B], DSP_connectors[2D], MEMORY2[2B], MEMORY2[2C]), A14 (bidir, see DSP[2B], DSP_connectors[2D], MEMORY2[2B], MEMORY2[2C]), D0 (bidir, see DSP[1B], DSP_connectors[3C], MEMORY2[3A]), D1 (bidir, see DSP[1B], DSP_connectors[3C], MEMORY2[3A]), D2 (bidir, see DSP[1C], DSP_connectors[3C], MEMORY2[3A]), D3 (bidir, see DSP[1C], DSP_connectors[3C], MEMORY2[3A]), D4 (bidir, see DSP[1C], DSP_connectors[3C], MEMORY2[3A]), D5 (bidir, see DSP[1C], DSP_connectors[3C], MEMORY2[3A]), D6 (bidir, see DSP[1C], DSP_connectors[3C], MEMORY2[3A]), D7 (bidir, see DSP[1C], DSP_connectors[3C], MEMORY2[3A]), D8 (bidir, see DSP[1C], DSP_connectors[3C], MEMORY2[3B]), D9 (bidir, see DSP[1C], DSP_connectors[3C], MEMORY2[3B]), D10 (bidir, see DSP[1C], DSP_connectors[3C], MEMORY2[3B]), D11 (bidir, see DSP[1C], DSP_connectors[3C], MEMORY2[3C]), D12 (bidir, see DSP[1C], DSP_connectors[3D], MEMORY2[3C]), D13 (bidir, see DSP[1C], DSP_connectors[3D], MEMORY2[3C]), D14 (bidir, see DSP[1C], DSP_connectors[3D], MEMORY2[3C]), D15 (bidir, see DSP[1C], DSP_connectors[3D], MEMORY2[3C]), OE (bidir, see MEMORY2[3A]), PS (bidir, see DSP[4B], DSP_connectors[3B])

### Nets
GND: U.12(GND_2) U.34(GND) U8.4(GND) U8.10(GND) U8.15(GND) U8.21(GND) U8.28(GND) U8.34(GND) U8.39(GND) U8.45(GND)
VCC: R33.1 U.2(VPP) U.44(VCC) U8.7(VCC) U8.18(VCC) U8.31(VCC) U8.42(VCC)
O0: U.21(O0) U8.47(1A1)
O1: U.20(O1) U8.46(1A2)
O2: U.19(O2) U8.44(1A3)
O3: U.18(O3) U8.43(1A4)
O4: U.17(O4) U8.41(1A5)
O5: U.16(O5) U8.40(1A6)
O6: U.15(O6) U8.38(1A7)
O7: U.14(O7) U8.37(1A8)
O8: U.11(O8) U8.36(2A1)
O9: U.10(O9) U8.35(2A2)
O10: U.9(O10) U8.33(2A3)
O11: U.8(O11) U8.32(2A4)
O12: U.7(O12) U8.30(2A5)
O13: U.6(O13) U8.29(2A6)
O14: U.5(O14) U8.27(2A7)
O15: U.4(O15) U8.26(2A8)
OE1: U8.1(1~{OE1}) U8.24(2~{OE1}) U8.25(2~{OE2}) U8.48(1~{OE2})
NetJ2_19: U.43(~{PGM}) ; port PS
NetJ3_9: U8.2(1Y1) ; port D0
NetJ3_10: U8.3(1Y2) ; port D1
NetJ3_11: U8.5(1Y3) ; port D2
NetJ3_12: U8.6(1Y4) ; port D3
NetJ3_13: U8.8(1Y5) ; port D4
NetJ3_14: U8.9(1Y6) ; port D5
NetJ3_15: U8.11(1Y7) ; port D6
NetJ3_16: U8.12(1Y8) ; port D7
NetJ3_17: U8.13(2Y1) ; port D8
NetJ3_18: U8.14(2Y2) ; port D9
NetJ3_19: U8.16(2Y3) ; port D10
NetJ3_20: U8.17(2Y4) ; port D11
NetJ3_21: U8.19(2Y5) ; port D12
NetJ3_22: U8.20(2Y6) ; port D13
NetJ3_23: U8.22(2Y7) ; port D14
NetJ3_24: U8.23(2Y8) ; port D15
NetJ4_9: U.24(A0) ; port A0
NetJ4_10: U.25(A1) ; port A1
NetJ4_11: U.26(A2) ; port A2
NetJ4_12: U.27(A3) ; port A3
NetJ4_13: U.28(A4) ; port A4
NetJ4_14: U.29(A5) ; port A5
NetJ4_15: U.30(A6) ; port A6
NetJ4_16: U.31(A7) ; port A7
NetJ4_17: U.32(A8) ; port A8
NetJ4_18: U.35(A9) ; port A9
NetJ4_19: U.36(A10) ; port A10
NetJ4_20: U.37(A11) ; port A11
NetJ4_21: U.38(A12) ; port A12
NetJ4_22: U.39(A13) ; port A13
NetJ4_23: U.40(A14) ; port A14
NetJ7_3: U.22(~{OE}) ; port OE
NetR33_2: R33.2 U.3(~{CE})

Not connected (* = marked no-connect by the designer): U 1(NC_2)* 13(NC_3)* 23(NC_4)* 33(NC_5)* 41(A15)* 42(NC)*

### Library data of the parts
R33 = CMP-2100-03673-1: as R1 on sheet DSP; Height: 0.5mm; Depth: 1.25mm; Case Code (Imperial): 0805; Lead Free: LeadFree; Military Standard: Not; Package Description: 2-Pin Surface Mounted Device, Body 2 x 1.25 mm; Case Code (Metric): 2012; Composition: ThickFilm; Voltage Rating: 150V; Manufacturer URL: http://www.yageo.com/; Packaging: TapeandReel; Package Reference: 0805; REACH SVHC: Unknown; Tolerance: 5%; Case/Package: 0805; Max Operating Temperature: 155degC; Number of Pins: 2; Min Operating Temperature: -55degC; RoHSCompliant: true; Length: 2mm; Datasheet URL: http://www.yageo.com/NewPortal/yageodocoutput?fileName=/pdf/R-Chip/PYu-RC_Group_51_RoHS_L_5.pdf; Termination: SMD/SMT; Radiation Hardening: No; Width: 1.25mm; Contact Plating: Tin; Datasheet Version: Rev. 5, 10/2016
U = AT27C1024-70JU: EPROM - OTP Memory IC 1Mb _64K x 16_ Parallel 70ns 44-PLCC _16.6x16.6_; MF: Microchip; MP: AT27C1024-70JU; SnapEDA_Link: https://www.snapeda.com/parts/AT27C1024-70JU/Microchip/view-part/1129317/?ref=snap; Price: None; Availability: Unavailable; Package: PLCC-44 Microchip; Value: *
U8 = CMP-0440-00612-3: 16-Bit Buffers/Drivers With 3-State Outputs, DL0048A, TUBE; Manufacturer: Texas Instruments; VCC(Min)(V): 4.5; VCC(Max)(V): 5.5; Input Type: TTL; F @ Nom Voltage(Max)(Mhz): 150; Rating: Catalog; ICC @ Nom Voltage(Max)(mA): 0.034; Bits(#): 16; Voltage(Nom)(V): 5; tpd @ Nom Voltage(Max)(ns): 4.2; PackageVersion: http://www.ti.com/lit/ml/mpds490/mpds490.pdf; PackageReference: DL0048A; Code_JEDEC: MO-118; Operating Temperature Range(C): -40 to 85; Generic Part Number: SN74ABT16541A; DatasheetVersion: SCBS118C; Output Type: TTL

## Sheet MEMORY2.SchDoc
size A; SheetNumber: 5; SheetTotal: 6
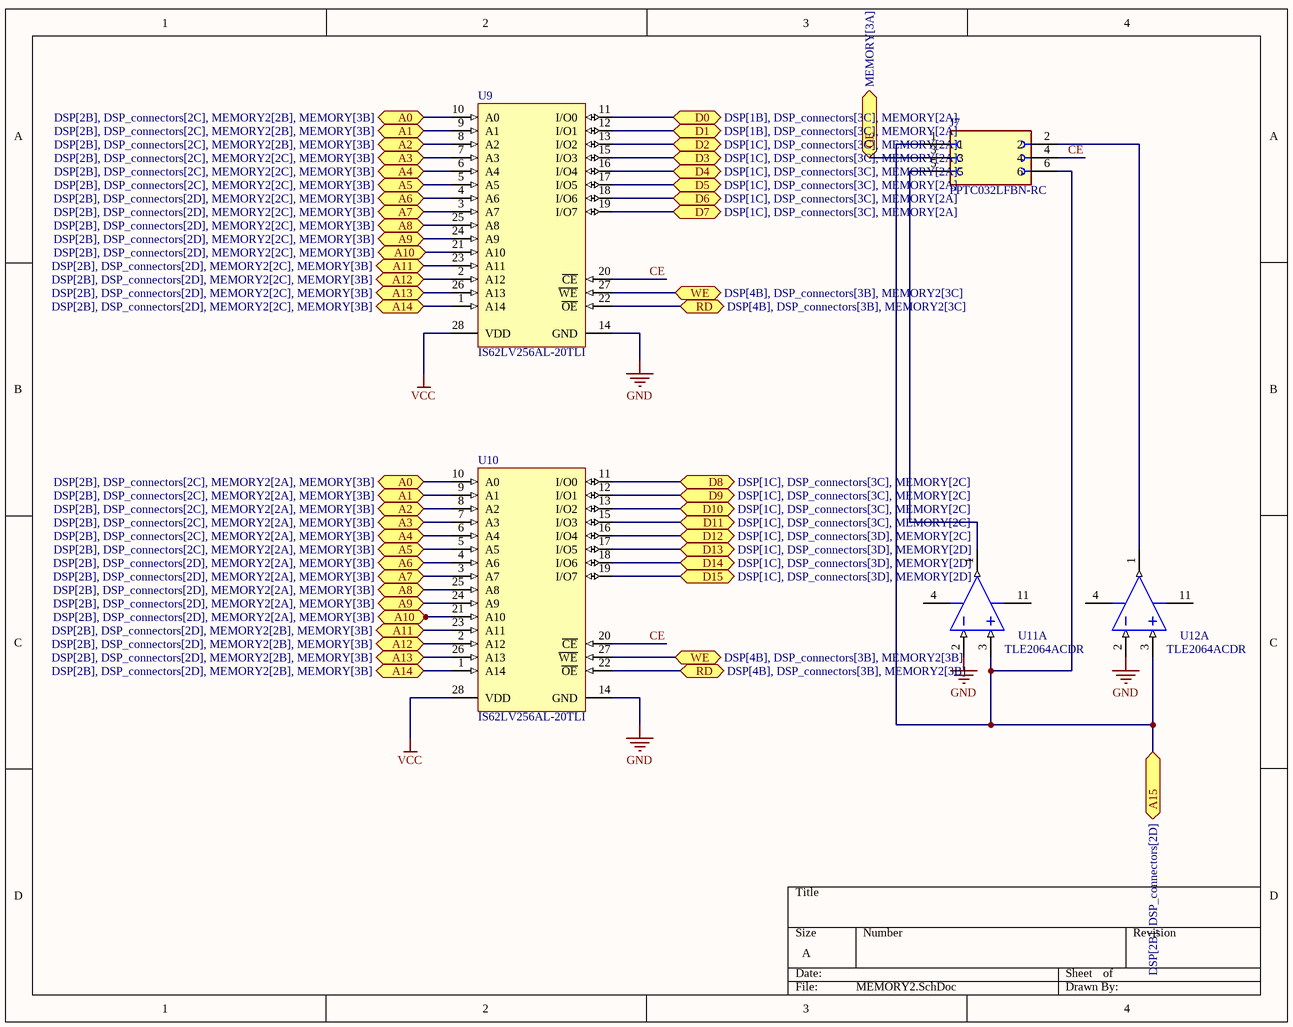
[diagram p4: MEMORY2.SchDoc]

### Parts
J7  PPTC032LFBN-RC  [SULLINS_PPTC032LFBN-RC]
U9  IS62LV256AL-20TLI  [ISSI-TSOP-1-28-8000X13400DE_N]
U10  IS62LV256AL-20TLI  [ISSI-TSOP-1-28-8000X13400DE_N]
U11  TLE2064ACDR  [D0014A_M]  (part A of 4)
U12  TLE2064ACDR  [D0014A_M]  (part A of 4)

### Ports
A0 (bidir, see DSP[2B], DSP_connectors[2C], MEMORY2[2A], MEMORY[3B]), A0 (bidir, see DSP[2B], DSP_connectors[2C], MEMORY2[2B], MEMORY[3B]), A1 (bidir, see DSP[2B], DSP_connectors[2C], MEMORY2[2A], MEMORY[3B]), A1 (bidir, see DSP[2B], DSP_connectors[2C], MEMORY2[2B], MEMORY[3B]), A2 (bidir, see DSP[2B], DSP_connectors[2C], MEMORY2[2A], MEMORY[3B]), A2 (bidir, see DSP[2B], DSP_connectors[2C], MEMORY2[2B], MEMORY[3B]), A3 (bidir, see DSP[2B], DSP_connectors[2C], MEMORY2[2A], MEMORY[3B]), A3 (bidir, see DSP[2B], DSP_connectors[2C], MEMORY2[2C], MEMORY[3B]), A4 (bidir, see DSP[2B], DSP_connectors[2C], MEMORY2[2A], MEMORY[3B]), A4 (bidir, see DSP[2B], DSP_connectors[2C], MEMORY2[2C], MEMORY[3B]), A5 (bidir, see DSP[2B], DSP_connectors[2C], MEMORY2[2A], MEMORY[3B]), A5 (bidir, see DSP[2B], DSP_connectors[2C], MEMORY2[2C], MEMORY[3B]), A6 (bidir, see DSP[2B], DSP_connectors[2D], MEMORY2[2A], MEMORY[3B]), A6 (bidir, see DSP[2B], DSP_connectors[2D], MEMORY2[2C], MEMORY[3B]), A7 (bidir, see DSP[2B], DSP_connectors[2D], MEMORY2[2A], MEMORY[3B]), A7 (bidir, see DSP[2B], DSP_connectors[2D], MEMORY2[2C], MEMORY[3B]), A8 (bidir, see DSP[2B], DSP_connectors[2D], MEMORY2[2A], MEMORY[3B]), A8 (bidir, see DSP[2B], DSP_connectors[2D], MEMORY2[2C], MEMORY[3B]), A9 (bidir, see DSP[2B], DSP_connectors[2D], MEMORY2[2A], MEMORY[3B]), A9 (bidir, see DSP[2B], DSP_connectors[2D], MEMORY2[2C], MEMORY[3B]), A10 (bidir, see DSP[2B], DSP_connectors[2D], MEMORY2[2A], MEMORY[3B]), A10 (bidir, see DSP[2B], DSP_connectors[2D], MEMORY2[2C], MEMORY[3B]), A11 (bidir, see DSP[2B], DSP_connectors[2D], MEMORY2[2B], MEMORY[3B]), A11 (bidir, see DSP[2B], DSP_connectors[2D], MEMORY2[2C], MEMORY[3B]), A12 (bidir, see DSP[2B], DSP_connectors[2D], MEMORY2[2B], MEMORY[3B]), A12 (bidir, see DSP[2B], DSP_connectors[2D], MEMORY2[2C], MEMORY[3B]), A13 (bidir, see DSP[2B], DSP_connectors[2D], MEMORY2[2B], MEMORY[3B]), A13 (bidir, see DSP[2B], DSP_connectors[2D], MEMORY2[2C], MEMORY[3B]), A14 (bidir, see DSP[2B], DSP_connectors[2D], MEMORY2[2B], MEMORY[3B]), A14 (bidir, see DSP[2B], DSP_connectors[2D], MEMORY2[2C], MEMORY[3B]), A15 (bidir, see DSP[2B], DSP_connectors[2D]), D0 (bidir, see DSP[1B], DSP_connectors[3C], MEMORY[2A]), D1 (bidir, see DSP[1B], DSP_connectors[3C], MEMORY[2A]), D2 (bidir, see DSP[1C], DSP_connectors[3C], MEMORY[2A]), D3 (bidir, see DSP[1C], DSP_connectors[3C], MEMORY[2A]), D4 (bidir, see DSP[1C], DSP_connectors[3C], MEMORY[2A]), D5 (bidir, see DSP[1C], DSP_connectors[3C], MEMORY[2A]), D6 (bidir, see DSP[1C], DSP_connectors[3C], MEMORY[2A]), D7 (bidir, see DSP[1C], DSP_connectors[3C], MEMORY[2A]), D8 (bidir, see DSP[1C], DSP_connectors[3C], MEMORY[2C]), D9 (bidir, see DSP[1C], DSP_connectors[3C], MEMORY[2C]), D10 (bidir, see DSP[1C], DSP_connectors[3C], MEMORY[2C]), D11 (bidir, see DSP[1C], DSP_connectors[3C], MEMORY[2C]), D12 (bidir, see DSP[1C], DSP_connectors[3D], MEMORY[2C]), D13 (bidir, see DSP[1C], DSP_connectors[3D], MEMORY[2D]), D14 (bidir, see DSP[1C], DSP_connectors[3D], MEMORY[2D]), D15 (bidir, see DSP[1C], DSP_connectors[3D], MEMORY[2D]), OE (bidir, see MEMORY[3A]), RD (bidir, see DSP[4B], DSP_connectors[3B], MEMORY2[3B]), RD (bidir, see DSP[4B], DSP_connectors[3B], MEMORY2[3C]), WE (bidir, see DSP[4B], DSP_connectors[3B], MEMORY2[3B]), WE (bidir, see DSP[4B], DSP_connectors[3B], MEMORY2[3C])

### Nets
GND: U9.14(GND) U10.14(GND) U11.2(IN1-) U12.2(IN1-)
VCC: U9.28(VDD) U10.28(VDD)
CE: J7.4 U9.20(~{CE}) U10.20(~{CE})
NetJ2_23: U9.22(~{OE}) U10.22(~{OE}) ; port RD
NetJ2_24: U9.27(~{WE}) U10.27(~{WE}) ; port WE
NetJ3_9: U9.11(I/O0) ; port D0
NetJ3_10: U9.12(I/O1) ; port D1
NetJ3_11: U9.13(I/O2) ; port D2
NetJ3_12: U9.15(I/O3) ; port D3
NetJ3_13: U9.16(I/O4) ; port D4
NetJ3_14: U9.17(I/O5) ; port D5
NetJ3_15: U9.18(I/O6) ; port D6
NetJ3_16: U9.19(I/O7) ; port D7
NetJ3_17: U10.11(I/O0) ; port D8
NetJ3_18: U10.12(I/O1) ; port D9
NetJ3_19: U10.13(I/O2) ; port D10
NetJ3_20: U10.15(I/O3) ; port D11
NetJ3_21: U10.16(I/O4) ; port D12
NetJ3_22: U10.17(I/O5) ; port D13
NetJ3_23: U10.18(I/O6) ; port D14
NetJ3_24: U10.19(I/O7) ; port D15
NetJ4_9: U9.10(A0) U10.10(A0) ; port A0
NetJ4_10: U9.9(A1) U10.9(A1) ; port A1
NetJ4_11: U9.8(A2) U10.8(A2) ; port A2
NetJ4_12: U9.7(A3) U10.7(A3) ; port A3
NetJ4_13: U9.6(A4) U10.6(A4) ; port A4
NetJ4_14: U9.5(A5) U10.5(A5) ; port A5
NetJ4_15: U9.4(A6) U10.4(A6) ; port A6
NetJ4_16: U9.3(A7) U10.3(A7) ; port A7
NetJ4_17: U9.25(A8) U10.25(A8) ; port A8
NetJ4_18: U9.24(A9) U10.24(A9) ; port A9
NetJ4_19: U9.21(A10) U10.21(A10) ; port A10
NetJ4_20: U9.23(A11) U10.23(A11) ; port A11
NetJ4_21: U9.2(A12) U10.2(A12) ; port A12
NetJ4_22: U9.26(A13) U10.26(A13) ; port A13
NetJ4_23: U9.1(A14) U10.1(A14) ; port A14
NetJ4_24: J7.1 J7.6 U11.3(IN1+) U12.3(IN1+) ; port A15
NetJ7_2: J7.2 U12.1(OUT1)
NetJ7_3: J7.3 ; port OE
NetJ7_5: J7.5 U11.1(OUT1)

Not connected (* = marked no-connect by the designer): U11 4(VCC+) 11(VCC-); U12 4(VCC+) 11(VCC-)

### Library data of the parts
J7 = PPTC032LFBN-RC: 6 Position Header Connector 0.100 (2.54mm) Through Hole Tin; MF: Sullins Connector Solutions; Package: None; Price: None; Value: *; SnapEDA_Link: https://www.snapeda.com/parts/PPTC032LFBN-RC/Sullins+Connector+Solutions/view-part/?ref=snap; MP: PPTC032LFBN-RC; Availability: Not in stock; Check_prices: https://www.snapeda.com/parts/PPTC032LFBN-RC/Sullins+Connector+Solutions/view-part/?ref=eda
U9 U10 = CMP-0515-00096-2: 256 K Low Voltage CMOS SRAM, 32 K x 8, -40 to 85 degC, 28-Pin SOP (TSOP-1-28), Pb-Free; Manufacturer: Integrated Silicon Solution Inc (ISSI); Density: 256K; Organization: 32K x 8; Speed (ns): 20; Packing: Tray / Tube; RoHS: Pb-Free; ComponentLink2Description: Datasheet; Mounting Technology: Surface Mount; ComponentLink2URL: http://www.issi.com/WW/pdf/62-65LV256AL.pdf; ComponentLink3URL: http://www.issi.com/WW/pdf/62-65C256AL.pdf; ComponentLink1URL: http://www.issi.com/US/index.shtml; ComponentLink1Description: Manufacturer URL; ComponentLink3Description: Package Specification; PackageVersion: Rev. F, 09/2009; PackageReference: TSOP-1-28; Code_JEDEC: MO- 183; PartNumber: IS62LV256AL-20TLI; PackageDescription: 28-Pin 8 x 13.4 mm TSOP-1, Pitch 0.55 mm; DatasheetVersion: Rev. C
U11 U12 = CMP-0272-01885-3: as U3 on sheet DSP; Code_JEDEC: MS-012; Eco-Plan: Green (RoHS & no Sb/Br); ComponentLink2Description: Datasheet; PackageVersion: 4040047-5/M, 06/2011; ComponentLink3Description: Package Specification; Offset Drift(Typ)(uV/C): 6; PackageDescription: 14-Pin Plastic Small Outline, Body 8.65 x 3.9 mm, Pitch 1.27 mm; Mounting Technology: Surface Mount; PackageReference: D0014A; ComponentLink2URL: http://www.ti.com/lit/ds/symlink/tle2064a.pdf; DatasheetVersion: SLOS193B; ComponentLink3URL: http://www.ti.com/lit/ml/mpds177g/mpds177g.pdf; PartNumber: TLE2064ACDR; ComponentLink1Description: Manufacturer URL; ComponentLink1URL: http://www.ti.com/

## Sheet power.SchDoc
size A; SheetNumber: 6; SheetTotal: 6
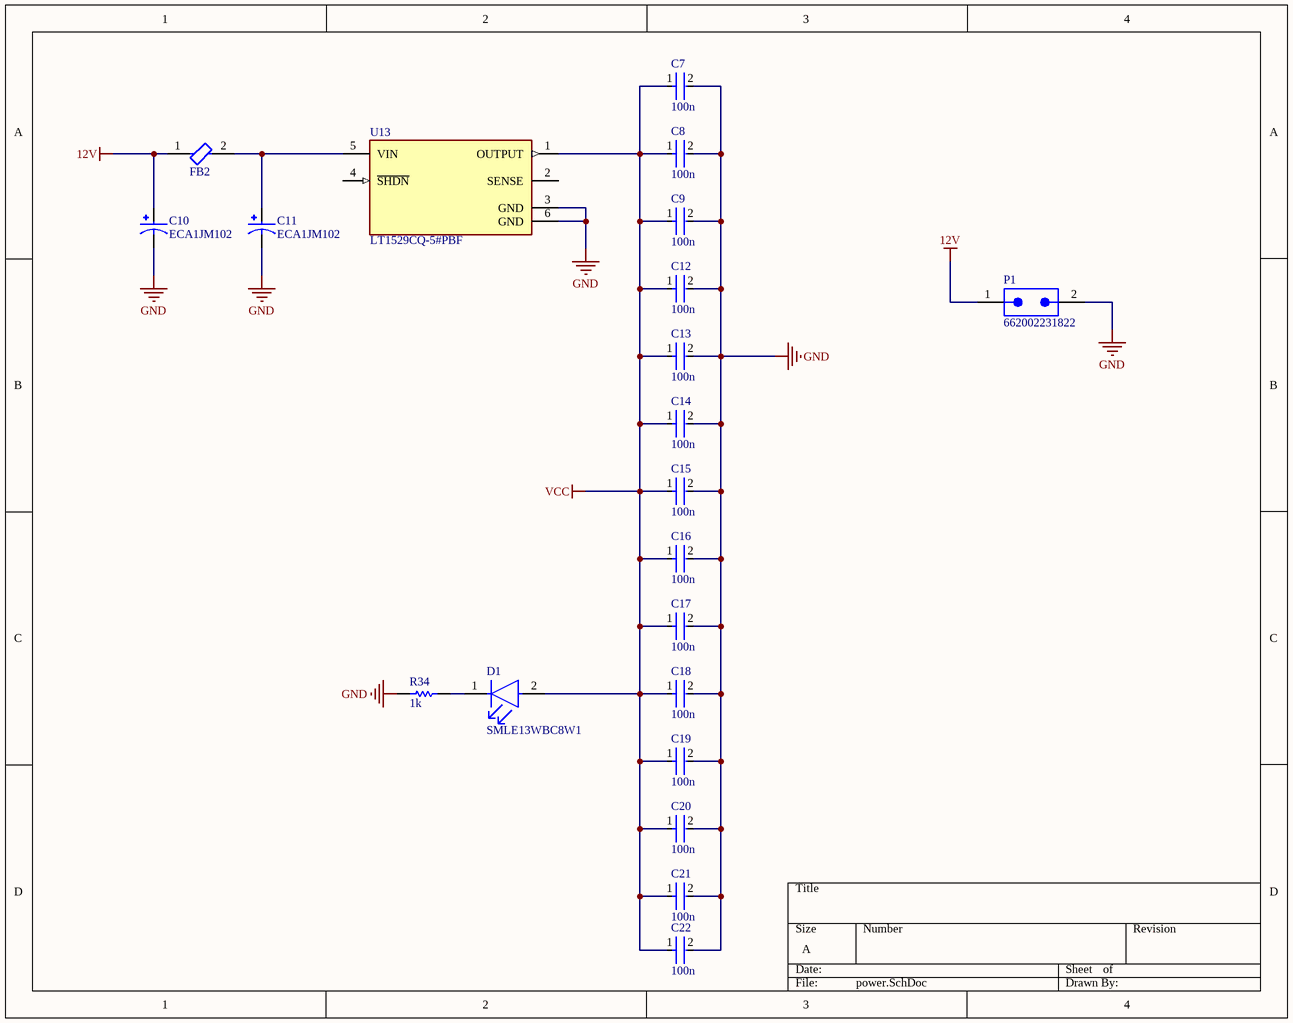
[diagram p5: power.SchDoc]

### Parts
C7  100n  [FP-CL10-IPC_C]
C8  100n  [FP-CL10-IPC_C]
C9  100n  [FP-CL10-IPC_C]
C10  ECA1JM102  [CAPPRD750W80D1600H2500]
C11  ECA1JM102  [CAPPRD750W80D1600H2500]
C12  100n  [FP-CL10-IPC_C]
C13  100n  [FP-CL10-IPC_C]
C14  100n  [FP-CL10-IPC_C]
C15  100n  [FP-CL10-IPC_C]
C16  100n  [FP-CL10-IPC_C]
C17  100n  [FP-CL10-IPC_C]
C18  100n  [FP-CL10-IPC_C]
C19  100n  [FP-CL10-IPC_C]
C20  100n  [FP-CL10-IPC_C]
C21  100n  [FP-CL10-IPC_C]
C22  100n  [FP-CL10-IPC_C]
D1  SMLE13WBC8W1  [FP-SMLE13WBC8W1-MFG]
FB2  BLM18KG121TN1D  [FP-BLM18-0_15-t0_6-d1_2-IPC_A]  (value not drawn)
P1  662002231822  [662002231822]
R34  1k  [RESC2013X60X35ML10T20]
U13  LT1529CQ-5#PBF  [FP-Q-5-05-08-1461-MFG]

### Nets
12V: C10.P FB2.1 P1.1
GND: C7.2 C8.2 C9.2 C10.N C11.N C12.2 C13.2 C14.2 C15.2 C16.2 C17.2 C18.2 C19.2 C20.2 C21.2 C22.2 P1.2 R34.1 U13.3(GND) U13.6(GND)
VCC: C7.1 C8.1 C9.1 C12.1 C13.1 C14.1 C15.1 C16.1 C17.1 C18.1 C19.1 C20.1 C21.1 C22.1 D1.2(A) U13.1(OUTPUT)
NetC11_P: C11.P FB2.2 U13.5(VIN)
NetD1_1: D1.1(C) R34.2

Not connected (* = marked no-connect by the designer): U13 2(SENSE) 4(~{SHDN})

### Library data of the parts
C7-C9 C12-C22 = CMP-13271-003017-1: as C1 on sheet DSP; Capacitance: 4.7uF; Case/Package: 0603; Packaging: Tape and Reel; Width: 0.031inch; Contact Plating: Tin; Thickness: 0.035inch; Package Quantity: 1; Voltage Rating: 10V; Case Code (Metric): 1608; Case Code (Imperial): 0603; Depth: 0.8mm; Height: 0.8mm; Tolerance: 10%; Max Operating Temperature: 85°C; Length: 1.6mm; Dielectric: X5R; Mount: Surface Mount; Radiation Hardening: No; Min Operating Temperature: -55°C
C10 C11 = ECA1JM102: 1000ÂµF 63V Aluminum Electrolytic Capacitors Radial, Can 2000 Hrs @ 85Â°C; MF: Panasonic; Availability: Not in stock; Check_prices: https://www.snapeda.com/parts/ECA1JM102/Panasonic/view-part/5782477/?ref=eda; Package: RADIAL-2 Panasonic; SnapEDA_Link: https://www.snapeda.com/parts/ECA1JM102/Panasonic/view-part/5782477/?ref=snap; MP: ECA1JM102; Price: None; Value: *
D1 = CMP-08952-000004-1: LED WHITE 0603 SMD; Manufacturer: Rohm; Luminous Intensity: 140mcd; Led Orientation: Top View; Reverse Voltage: 5V; Forward Voltage: 2.9V; Forward Current: 5mA; Power Dissipation: 66mW; Temperature Range Low: -40°C; Digikey Description: LED WHITE 0603 SMD; Temperature Range High: +85°C; Temperature: -40°C to +85°C; Manufacturer Part Number: SMLE13WBC8W1; Colour: White; Mouser Description: Standard LEDs - SMD ExceLED White LED 120mcd 5mA; Octopart: https://octopart.com/smle13wbc8w1-rohm-22224565; Automotive: No; Device Class L2: LEDs; Lead Free: Yes; ComponentLink2URL: https://media.digikey.com/pdf/Data%20Sheets/Rohm%20PDFs/SMLE13WBC8W1_Spec.pdf; Device Class L3: unset; Package: 0; RoHS: TRUE; Height: 0.4mm; Category: Diode; Device Class L1: Optoelectronics; ComponentLink2Description: Datasheet
FB2 = CMP-0686-00554-8: as FB1 on sheet DSP; Package Quantity: 4000; Min Operating Temperature: -55°C; Termination: SMD/SMT; REACH SVHC: No SVHC; Core Material: Ferrite; Material: Ferrite; Current Rating: 3A; Height: 0.8mm; Number of Pins: 2; Case/Package: 0603; Case Code (Imperial): 0603; Series: BLM18K; Packaging: Tape and Reel; Inductor Type: FERRITE BEAD; Lead Free: Lead Free; Width: 0.8mm; Case Code (Metric): 1608; Number of Circuits: 1; Max DC Current: 3A; Depth: 0.95mm; Max Operating Temperature: 125°C; Length: 1.6mm; RoHS Compliant: Yes
P1 = CMP-1502-00340-2: NexarPartId: 8917600; Contact Resistance: 10mΩ; Connector Type: Male Pin, Socket; Row Spacing: 2.9972mm; Number of Contacts: 2; Gender: Male; Operating Supply Voltage: 250V; Current Rating: 5A; Pitch: 3mm; Insulation Resistance: 1GΩ; Contact Material: Copper; Lead Pitch: 3mm; Mount: Surface Mount; Number of Pins: 2; Max Operating Temperature: 105°C; Contact Plating: Tin; RoHS: Compliant; Color: Black; Width: 6.7mm; Termination: Solder; Fastening Type: Ramp; Number of Rows: 2; Height: 9.9mm; Min Operating Temperature: -40°C; Length: 6.7mm; Orientation: Vertical; REACH SVHC: Unknown; Housing Material: Nylon; Number of Positions: 2
R34 = CMP-2100-03673-1: as R1 on sheet DSP; Height: 0.5mm; Depth: 1.25mm; Case Code (Imperial): 0805; Lead Free: LeadFree; Military Standard: Not; Package Description: 2-Pin Surface Mounted Device, Body 2 x 1.25 mm; Case Code (Metric): 2012; Composition: ThickFilm; Voltage Rating: 150V; Manufacturer URL: http://www.yageo.com/; Packaging: TapeandReel; Package Reference: 0805; REACH SVHC: Unknown; Tolerance: 5%; Case/Package: 0805; Max Operating Temperature: 155degC; Number of Pins: 2; Min Operating Temperature: -55degC; RoHSCompliant: true; Length: 2mm; Datasheet URL: http://www.yageo.com/NewPortal/yageodocoutput?fileName=/pdf/R-Chip/PYu-RC_Group_51_RoHS_L_5.pdf; Termination: SMD/SMT; Radiation Hardening: No; Width: 1.25mm; Contact Plating: Tin; Datasheet Version: Rev. 5, 10/2016
U13 = CMP-0476-01142-2: NexarPartId: 533167; Output Voltage: 5V; Nominal Supply Current: 50µA; Number of Channels: 1; Min Current Limit: 3.2A; Max Input Voltage: 15V; Output Current: 3A; Min Input Voltage: 3.8V; Dropout Voltage: 600mV; Max Junction Temperature (Tj): 125°C; Power Supply Rejection Ratio (PSRR): 62dB; Polarity: Positive; Output Type: Fixed; Nominal Output Voltage: 5V; Width: 9.4mm; Length: 10.54mm; Schedule B: 8542390000, 8542390000; Radiation Hardening: No; Packaging: Bulk; Max Supply Voltage: 15V; Operating Supply Current: 50µA; RoHS: Compliant; Max Output Current: 3A; Max Operating Temperature: 125°C; Min Operating Temperature: 0°C; Number of Pins: 5; Quiescent Current: 50µA; Lead Free: Lead Free; Case/Package: Q; Number of Regulators: 1; REACH SVHC: No SVHC; Height: 4.57mm; Lifecycle Status: Production; Number of Outputs: 1

## Nets that join several sheets
12V: DSP_connectors (J1.11), power (C10.P FB2.1 P1.1)
GND: DSP (30 pins), DSP_connectors (15 pins), DSP_2 (5 pins), MEMORY (10 pins), MEMORY2 (U9.14 U10.14 U11.2 U12.2), power (20 pins)
VCC: DSP (32 pins), DSP_connectors (5 pins), DSP_2 (J5.5), MEMORY (7 pins), MEMORY2 (U9.28 U10.28), power (16 pins)
NetJ1_3: DSP (R24.2 R26.1 U7.2), DSP_connectors (J1.3)
NetJ1_5: DSP (U6.27), DSP_connectors (J1.5)
NetJ1_6: DSP (U6.28), DSP_connectors (J1.6)
NetJ1_14: DSP (U2.84 U2.87 U6.13), DSP_connectors (J1.14 J1.16)
NetJ1_17: DSP (U2.96), DSP_connectors (J1.17), DSP_2 (J6.7)
NetJ1_18: DSP (U2.85 U6.12), DSP_connectors (J1.18)
NetJ1_19: DSP (U2.97), DSP_connectors (J1.19), DSP_2 (J6.8)
NetJ1_20: DSP (U2.89), DSP_connectors (J1.20)
NetJ1_21: DSP (U2.8), DSP_connectors (J1.21), DSP_2 (J6.4)
NetJ1_22: DSP (U2.86), DSP_connectors (J1.22)
NetJ1_23: DSP (U2.9), DSP_connectors (J1.23), DSP_2 (J6.9)
NetJ1_24: DSP (U2.90 U6.10), DSP_connectors (J1.24)
NetJ2_1: DSP (U2.100), DSP_connectors (J2.1)
NetJ2_2: DSP (U2.92), DSP_connectors (J2.2)
NetJ2_5: DSP (U2.98), DSP_connectors (J2.5)
NetJ2_6: DSP (R14.1 U2.6), DSP_connectors (J2.6)
NetJ2_9: DSP (U2.15), DSP_connectors (J2.9)
NetJ2_17: DSP (R18.1 U2.46), DSP_connectors (J2.17)
NetJ2_19: DSP (R16.1 U2.53), DSP_connectors (J2.19), MEMORY (U.43)
NetJ2_21: DSP (R13.1 U2.51), DSP_connectors (J2.21)
NetJ2_22: DSP (R15.1 U2.52), DSP_connectors (J2.22)
NetJ2_23: DSP (R17.1 U2.45), DSP_connectors (J2.23), MEMORY2 (U9.22 U10.22)
NetJ2_24: DSP (R19.1 U2.44), DSP_connectors (J2.24), MEMORY2 (U9.27 U10.27)
NetJ3_3: DSP (R11.2 U2.49), DSP_connectors (J3.3)
NetJ3_4: DSP (R4.1 U2.2), DSP_connectors (J3.4)
NetJ3_5: DSP (U2.99), DSP_connectors (J3.5)
NetJ3_6: DSP (R12.1 U2.43), DSP_connectors (J3.6)
NetJ3_9: DSP (U2.22), DSP_connectors (J3.9), MEMORY (U8.2), MEMORY2 (U9.11)
NetJ3_10: DSP (U2.23), DSP_connectors (J3.10), MEMORY (U8.3), MEMORY2 (U9.12)
NetJ3_11: DSP (U2.24), DSP_connectors (J3.11), MEMORY (U8.5), MEMORY2 (U9.13)
NetJ3_12: DSP (U2.26), DSP_connectors (J3.12), MEMORY (U8.6), MEMORY2 (U9.15)
NetJ3_13: DSP (U2.27), DSP_connectors (J3.13), MEMORY (U8.8), MEMORY2 (U9.16)
NetJ3_14: DSP (U2.28), DSP_connectors (J3.14), MEMORY (U8.9), MEMORY2 (U9.17)
NetJ3_15: DSP (U2.29), DSP_connectors (J3.15), MEMORY (U8.11), MEMORY2 (U9.18)
NetJ3_16: DSP (U2.31), DSP_connectors (J3.16), MEMORY (U8.12), MEMORY2 (U9.19)
NetJ3_17: DSP (U2.32), DSP_connectors (J3.17), MEMORY (U8.13), MEMORY2 (U10.11)
NetJ3_18: DSP (U2.33), DSP_connectors (J3.18), MEMORY (U8.14), MEMORY2 (U10.12)
NetJ3_19: DSP (U2.34), DSP_connectors (J3.19), MEMORY (U8.16), MEMORY2 (U10.13)
NetJ3_20: DSP (U2.36), DSP_connectors (J3.20), MEMORY (U8.17), MEMORY2 (U10.15)
NetJ3_21: DSP (U2.38), DSP_connectors (J3.21), MEMORY (U8.19), MEMORY2 (U10.16)
NetJ3_22: DSP (U2.39), DSP_connectors (J3.22), MEMORY (U8.20), MEMORY2 (U10.17)
NetJ3_23: DSP (U2.40), DSP_connectors (J3.23), MEMORY (U8.22), MEMORY2 (U10.18)
NetJ3_24: DSP (U2.41), DSP_connectors (J3.24), MEMORY (U8.23), MEMORY2 (U10.19)
NetJ4_1: DSP (R3.1 U2.18), DSP_connectors (J4.1)
NetJ4_2: DSP (R2.1 U2.19), DSP_connectors (J4.2)
NetJ4_3: DSP (R1.1 U2.20), DSP_connectors (J4.3)
NetJ4_5: DSP (R5.1 U2.17), DSP_connectors (J4.5)
NetJ4_9: DSP (U2.55), DSP_connectors (J4.9), MEMORY (U.24), MEMORY2 (U9.10 U10.10)
NetJ4_10: DSP (U2.56), DSP_connectors (J4.10), MEMORY (U.25), MEMORY2 (U9.9 U10.9)
NetJ4_11: DSP (U2.57), DSP_connectors (J4.11), MEMORY (U.26), MEMORY2 (U9.8 U10.8)
NetJ4_12: DSP (U2.58), DSP_connectors (J4.12), MEMORY (U.27), MEMORY2 (U9.7 U10.7)
NetJ4_13: DSP (U2.60), DSP_connectors (J4.13), MEMORY (U.28), MEMORY2 (U9.6 U10.6)
NetJ4_14: DSP (U2.61), DSP_connectors (J4.14), MEMORY (U.29), MEMORY2 (U9.5 U10.5)
NetJ4_15: DSP (U2.62), DSP_connectors (J4.15), MEMORY (U.30), MEMORY2 (U9.4 U10.4)
NetJ4_16: DSP (U2.64), DSP_connectors (J4.16), MEMORY (U.31), MEMORY2 (U9.3 U10.3)
NetJ4_17: DSP (U2.66), DSP_connectors (J4.17), MEMORY (U.32), MEMORY2 (U9.25 U10.25)
NetJ4_18: DSP (U2.67), DSP_connectors (J4.18), MEMORY (U.35), MEMORY2 (U9.24 U10.24)
NetJ4_19: DSP (U2.68), DSP_connectors (J4.19), MEMORY (U.36), MEMORY2 (U9.21 U10.21)
NetJ4_20: DSP (U2.69), DSP_connectors (J4.20), MEMORY (U.37), MEMORY2 (U9.23 U10.23)
NetJ4_21: DSP (U2.71), DSP_connectors (J4.21), MEMORY (U.38), MEMORY2 (U9.2 U10.2)
NetJ4_22: DSP (U2.72), DSP_connectors (J4.22), MEMORY (U.39), MEMORY2 (U9.26 U10.26)
NetJ4_23: DSP (U2.73), DSP_connectors (J4.23), MEMORY (U.40), MEMORY2 (U9.1 U10.1)
NetJ4_24: DSP (U2.74), DSP_connectors (J4.24), MEMORY2 (J7.1 J7.6 U11.3 U12.3)
NetJ5_1: DSP (U2.81), DSP_2 (J5.1)
NetJ5_2: DSP (U2.79), DSP_2 (J5.2)
NetJ5_3: DSP (U2.80), DSP_2 (J5.3)
NetJ5_7: DSP (U2.82), DSP_2 (J5.7)
NetJ5_9: DSP (U2.78), DSP_2 (J5.9 J5.11)
NetJ5_13: DSP (R23.2 U2.76), DSP_2 (J5.13)
NetJ5_14: DSP (R22.2 U2.77), DSP_2 (J5.14)
NetJ6_1: DSP (U2.13), DSP_2 (J6.1)
NetJ6_2: DSP (U2.93), DSP_2 (J6.2)
NetJ6_5: DSP (U2.47), DSP_2 (J6.5)
NetJ6_6: DSP (U2.95), DSP_2 (J6.6)
NetJ7_3: MEMORY (U.22), MEMORY2 (J7.3)
OUT+: DSP (R27.2 U6.3), DSP_connectors (J1.4)